# Altium schematic sheet Hole4.SchDoc
size A
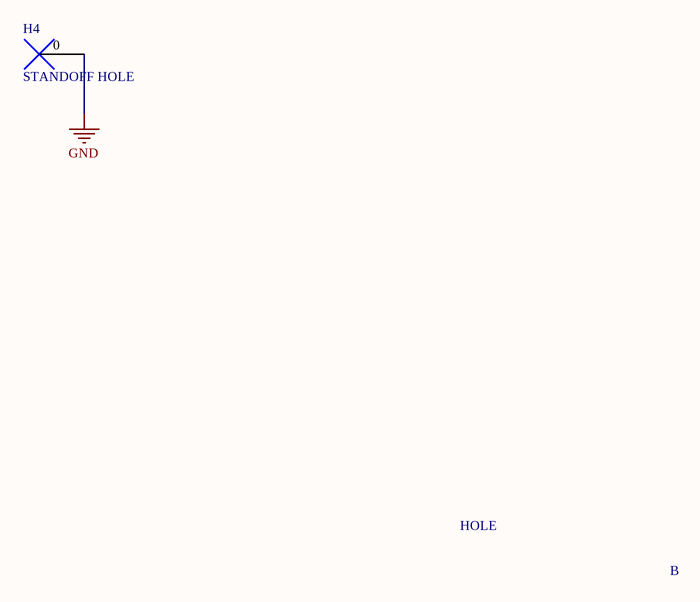
[diagram p0: Hole4.SchDoc]

## Parts
H4  STANDOFF HOLE  [HOLE_3.5MM]

## Nets
GND: H4.0

## Notes on the sheet
- HOLE
- B